# Altium schematic sheet Main.SchDoc
size A3; SheetNumber: 1; SheetTotal: 8
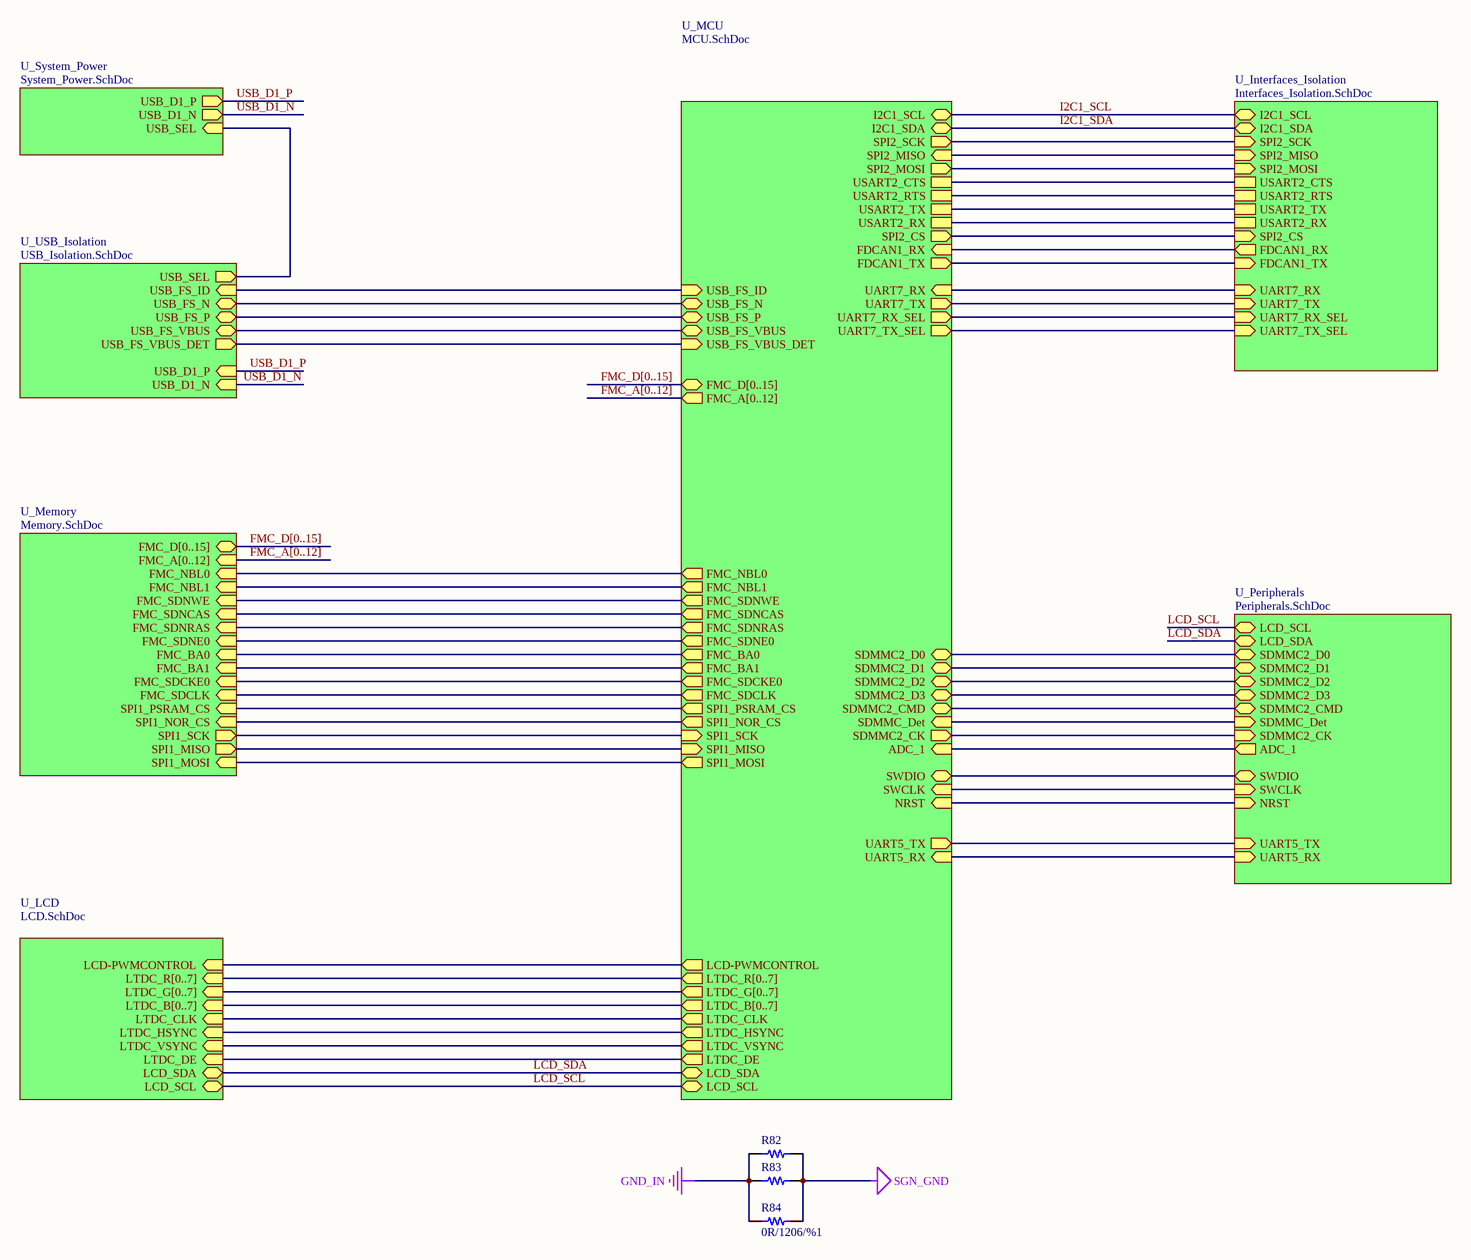
[diagram p0: Main.SchDoc]

## Parts
R82  0R/1206/%1  [1206_res]  (value not drawn)
R83  0R/1206/%1  [1206_res]  (value not drawn)
R84  0R/1206/%1  [1206_res]

## Sub-sheets
U_Interfaces_Isolation = Interfaces_Isolation.SchDoc: I2C1_SCL (bidir), I2C1_SDA (bidir), SPI2_SCK (in), SPI2_MISO (in), SPI2_MOSI (in), USART2_CTS, USART2_RTS, USART2_TX, USART2_RX, FDCAN1_RX (out), FDCAN1_TX (in), SPI2_CS (in), UART7_RX (in), UART7_TX (in), UART7_RX_SEL (in), UART7_TX_SEL (in)
U_LCD = LCD.SchDoc: LTDC_R[0..7] (in), LTDC_G[0..7] (in), LTDC_B[0..7] (in), LTDC_CLK (in), LTDC_HSYNC (in), LTDC_VSYNC (in), LTDC_DE (in), LCD_SDA (bidir), LCD_SCL (bidir), LCD-PWMCONTROL (in)
U_MCU = MCU.SchDoc: LTDC_R[0..7] (out), LTDC_G[0..7] (out), LTDC_B[0..7] (out), FMC_D[0..15] (bidir), FMC_A[0..12] (out), FMC_NBL1 (out), FMC_SDNWE (out), FMC_SDNCAS (out), FMC_SDNRAS (out), FMC_SDNE0 (out), FMC_BA0 (out), FMC_BA1 (out), FMC_SDCKE0 (out), FMC_SDCLK (out), FMC_NBL0 (out), USART2_CTS, USART2_RTS, USART2_TX, USART2_RX, SPI1_MISO (in), SPI1_MOSI (out), SPI1_SCK (in), I2C1_SCL (bidir), I2C1_SDA (bidir), LCD_SDA (bidir), LCD_SCL (bidir), FDCAN1_RX (in), FDCAN1_TX (out), SPI2_MOSI (out), SPI2_SCK (out), SPI2_MISO (in), LCD-PWMCONTROL (out), LTDC_VSYNC (out), LTDC_HSYNC (out), LTDC_DE (out), LTDC_CLK (out), SPI1_NOR_CS (out), SPI2_CS (out), SPI1_PSRAM_CS (out), SDMMC2_D0 (bidir), SDMMC2_D1 (bidir), SDMMC2_D2 (bidir), SDMMC2_D3 (bidir), SDMMC2_CMD (bidir), SDMMC2_CK (out), SWDIO (bidir), SWCLK (in), NRST (in), UART5_RX (in), UART5_TX (out), SDMMC_Det (in), UART7_RX (in), UART7_TX (out), UART7_RX_SEL (out), UART7_TX_SEL (out), ADC_1 (in), USB_FS_ID (in), USB_FS_VBUS (bidir), USB_FS_N (bidir), USB_FS_P (bidir), USB_FS_VBUS_DET (in)
U_Memory = Memory.SchDoc: FMC_D[0..15] (bidir), FMC_A[0..12] (in), FMC_NBL1 (in), FMC_SDNWE (in), FMC_SDNCAS (in), FMC_SDNRAS (in), FMC_SDNE0 (in), FMC_BA0 (in), FMC_BA1 (in), FMC_SDCKE0 (in), FMC_SDCLK (in), FMC_NBL0 (in), SPI1_MISO (out), SPI1_MOSI (in), SPI1_SCK (out), SPI1_PSRAM_CS (in), SPI1_NOR_CS (in)
U_Peripherals = Peripherals.SchDoc: LCD_SCL (bidir), LCD_SDA (bidir), SDMMC2_D0 (bidir), SDMMC2_D1 (bidir), SDMMC2_D2 (bidir), SDMMC2_D3 (bidir), SDMMC2_CMD (bidir), SDMMC2_CK (in), SDMMC_Det (in), SWDIO (bidir), SWCLK (in), UART5_RX (in), UART5_TX (in), NRST (in), ADC_1 (out)
U_System_Power = System_Power.SchDoc: USB_D1_P (out), USB_D1_N (out), USB_SEL (in)
U_USB_Isolation = USB_Isolation.SchDoc: USB_D1_P (in), USB_D1_N (in), USB_SEL (out), USB_FS_ID (in), USB_FS_N (bidir), USB_FS_P (bidir), USB_FS_VBUS (bidir), USB_FS_VBUS_DET (out)

## Nets
GND_IN: R82.2 R83.2 R84.2
SGN_GND: R82.1 R83.1 R84.1
I2C1_SCL: sheet U_Interfaces_Isolation/I2C1_SCL, sheet U_MCU/I2C1_SCL
I2C1_SDA: sheet U_Interfaces_Isolation/I2C1_SDA, sheet U_MCU/I2C1_SDA
LCD_SCL: sheet U_LCD/LCD_SCL, sheet U_Peripherals/LCD_SCL, sheet U_MCU/LCD_SCL
LCD_SDA: sheet U_LCD/LCD_SDA, sheet U_Peripherals/LCD_SDA, sheet U_MCU/LCD_SDA
USB_D1_N: sheet U_System_Power/USB_D1_N, sheet U_USB_Isolation/USB_D1_N
USB_D1_P: sheet U_System_Power/USB_D1_P, sheet U_USB_Isolation/USB_D1_P
(unnamed): sheet U_Interfaces_Isolation/SPI2_SCK, sheet U_MCU/SPI2_SCK
(unnamed): sheet U_Interfaces_Isolation/SPI2_MISO, sheet U_MCU/SPI2_MISO
(unnamed): sheet U_Interfaces_Isolation/SPI2_MOSI, sheet U_MCU/SPI2_MOSI
(unnamed): sheet U_Interfaces_Isolation/USART2_CTS, sheet U_MCU/USART2_CTS
(unnamed): sheet U_Interfaces_Isolation/USART2_RTS, sheet U_MCU/USART2_RTS
(unnamed): sheet U_Interfaces_Isolation/USART2_TX, sheet U_MCU/USART2_TX
(unnamed): sheet U_Interfaces_Isolation/USART2_RX, sheet U_MCU/USART2_RX
(unnamed): sheet U_Interfaces_Isolation/FDCAN1_RX, sheet U_MCU/FDCAN1_RX
(unnamed): sheet U_Interfaces_Isolation/FDCAN1_TX, sheet U_MCU/FDCAN1_TX
(unnamed): sheet U_Interfaces_Isolation/SPI2_CS, sheet U_MCU/SPI2_CS
(unnamed): sheet U_Interfaces_Isolation/UART7_RX, sheet U_MCU/UART7_RX
(unnamed): sheet U_Interfaces_Isolation/UART7_TX, sheet U_MCU/UART7_TX
(unnamed): sheet U_Interfaces_Isolation/UART7_RX_SEL, sheet U_MCU/UART7_RX_SEL
(unnamed): sheet U_Interfaces_Isolation/UART7_TX_SEL, sheet U_MCU/UART7_TX_SEL
(unnamed): sheet U_LCD/LTDC_CLK, sheet U_MCU/LTDC_CLK
(unnamed): sheet U_LCD/LTDC_HSYNC, sheet U_MCU/LTDC_HSYNC
(unnamed): sheet U_LCD/LTDC_VSYNC, sheet U_MCU/LTDC_VSYNC
(unnamed): sheet U_LCD/LTDC_DE, sheet U_MCU/LTDC_DE
(unnamed): sheet U_LCD/LCD-PWMCONTROL, sheet U_MCU/LCD-PWMCONTROL
(unnamed): sheet U_Memory/FMC_NBL1, sheet U_MCU/FMC_NBL1
(unnamed): sheet U_Memory/FMC_SDNWE, sheet U_MCU/FMC_SDNWE
(unnamed): sheet U_Memory/FMC_SDNCAS, sheet U_MCU/FMC_SDNCAS
(unnamed): sheet U_Memory/FMC_SDNRAS, sheet U_MCU/FMC_SDNRAS
(unnamed): sheet U_Memory/FMC_SDNE0, sheet U_MCU/FMC_SDNE0
(unnamed): sheet U_Memory/FMC_BA0, sheet U_MCU/FMC_BA0
(unnamed): sheet U_Memory/FMC_BA1, sheet U_MCU/FMC_BA1
(unnamed): sheet U_Memory/FMC_SDCKE0, sheet U_MCU/FMC_SDCKE0
(unnamed): sheet U_Memory/FMC_SDCLK, sheet U_MCU/FMC_SDCLK
(unnamed): sheet U_Memory/FMC_NBL0, sheet U_MCU/FMC_NBL0
(unnamed): sheet U_Memory/SPI1_MISO, sheet U_MCU/SPI1_MISO
(unnamed): sheet U_Memory/SPI1_MOSI, sheet U_MCU/SPI1_MOSI
(unnamed): sheet U_Memory/SPI1_SCK, sheet U_MCU/SPI1_SCK
(unnamed): sheet U_Memory/SPI1_PSRAM_CS, sheet U_MCU/SPI1_PSRAM_CS
(unnamed): sheet U_Memory/SPI1_NOR_CS, sheet U_MCU/SPI1_NOR_CS
(unnamed): sheet U_Peripherals/SDMMC2_D0, sheet U_MCU/SDMMC2_D0
(unnamed): sheet U_Peripherals/SDMMC2_D1, sheet U_MCU/SDMMC2_D1
(unnamed): sheet U_Peripherals/SDMMC2_D2, sheet U_MCU/SDMMC2_D2
(unnamed): sheet U_Peripherals/SDMMC2_D3, sheet U_MCU/SDMMC2_D3
(unnamed): sheet U_Peripherals/SDMMC2_CMD, sheet U_MCU/SDMMC2_CMD
(unnamed): sheet U_Peripherals/SDMMC2_CK, sheet U_MCU/SDMMC2_CK
(unnamed): sheet U_Peripherals/SDMMC_Det, sheet U_MCU/SDMMC_Det
(unnamed): sheet U_Peripherals/SWDIO, sheet U_MCU/SWDIO
(unnamed): sheet U_Peripherals/SWCLK, sheet U_MCU/SWCLK
(unnamed): sheet U_Peripherals/UART5_RX, sheet U_MCU/UART5_RX
(unnamed): sheet U_Peripherals/UART5_TX, sheet U_MCU/UART5_TX
(unnamed): sheet U_Peripherals/NRST, sheet U_MCU/NRST
(unnamed): sheet U_Peripherals/ADC_1, sheet U_MCU/ADC_1
(unnamed): sheet U_System_Power/USB_SEL, sheet U_USB_Isolation/USB_SEL
(unnamed): sheet U_USB_Isolation/USB_FS_ID, sheet U_MCU/USB_FS_ID
(unnamed): sheet U_USB_Isolation/USB_FS_N, sheet U_MCU/USB_FS_N
(unnamed): sheet U_USB_Isolation/USB_FS_P, sheet U_MCU/USB_FS_P
(unnamed): sheet U_USB_Isolation/USB_FS_VBUS, sheet U_MCU/USB_FS_VBUS
(unnamed): sheet U_USB_Isolation/USB_FS_VBUS_DET, sheet U_MCU/USB_FS_VBUS_DET

## Buses and harness runs
bus FMC_A[0..12] = sheet U_MCU/FMC_A[0..12]
bus FMC_A[0..12] = sheet U_Memory/FMC_A[0..12]
bus FMC_D[0..15] = sheet U_MCU/FMC_D[0..15]
bus FMC_D[0..15] = sheet U_Memory/FMC_D[0..15]
bus sheet U_LCD/LTDC_B[0..7] = sheet U_MCU/LTDC_B[0..7]
bus sheet U_LCD/LTDC_G[0..7] = sheet U_MCU/LTDC_G[0..7]
bus sheet U_LCD/LTDC_R[0..7] = sheet U_MCU/LTDC_R[0..7]

## Library data of the parts
R82-R84 = RES: Assembly: .; HelpURL: *; PN: *; Value: 0R/1206/%1